# EAGLE design PiMometer (EAGLE 6.5.0)
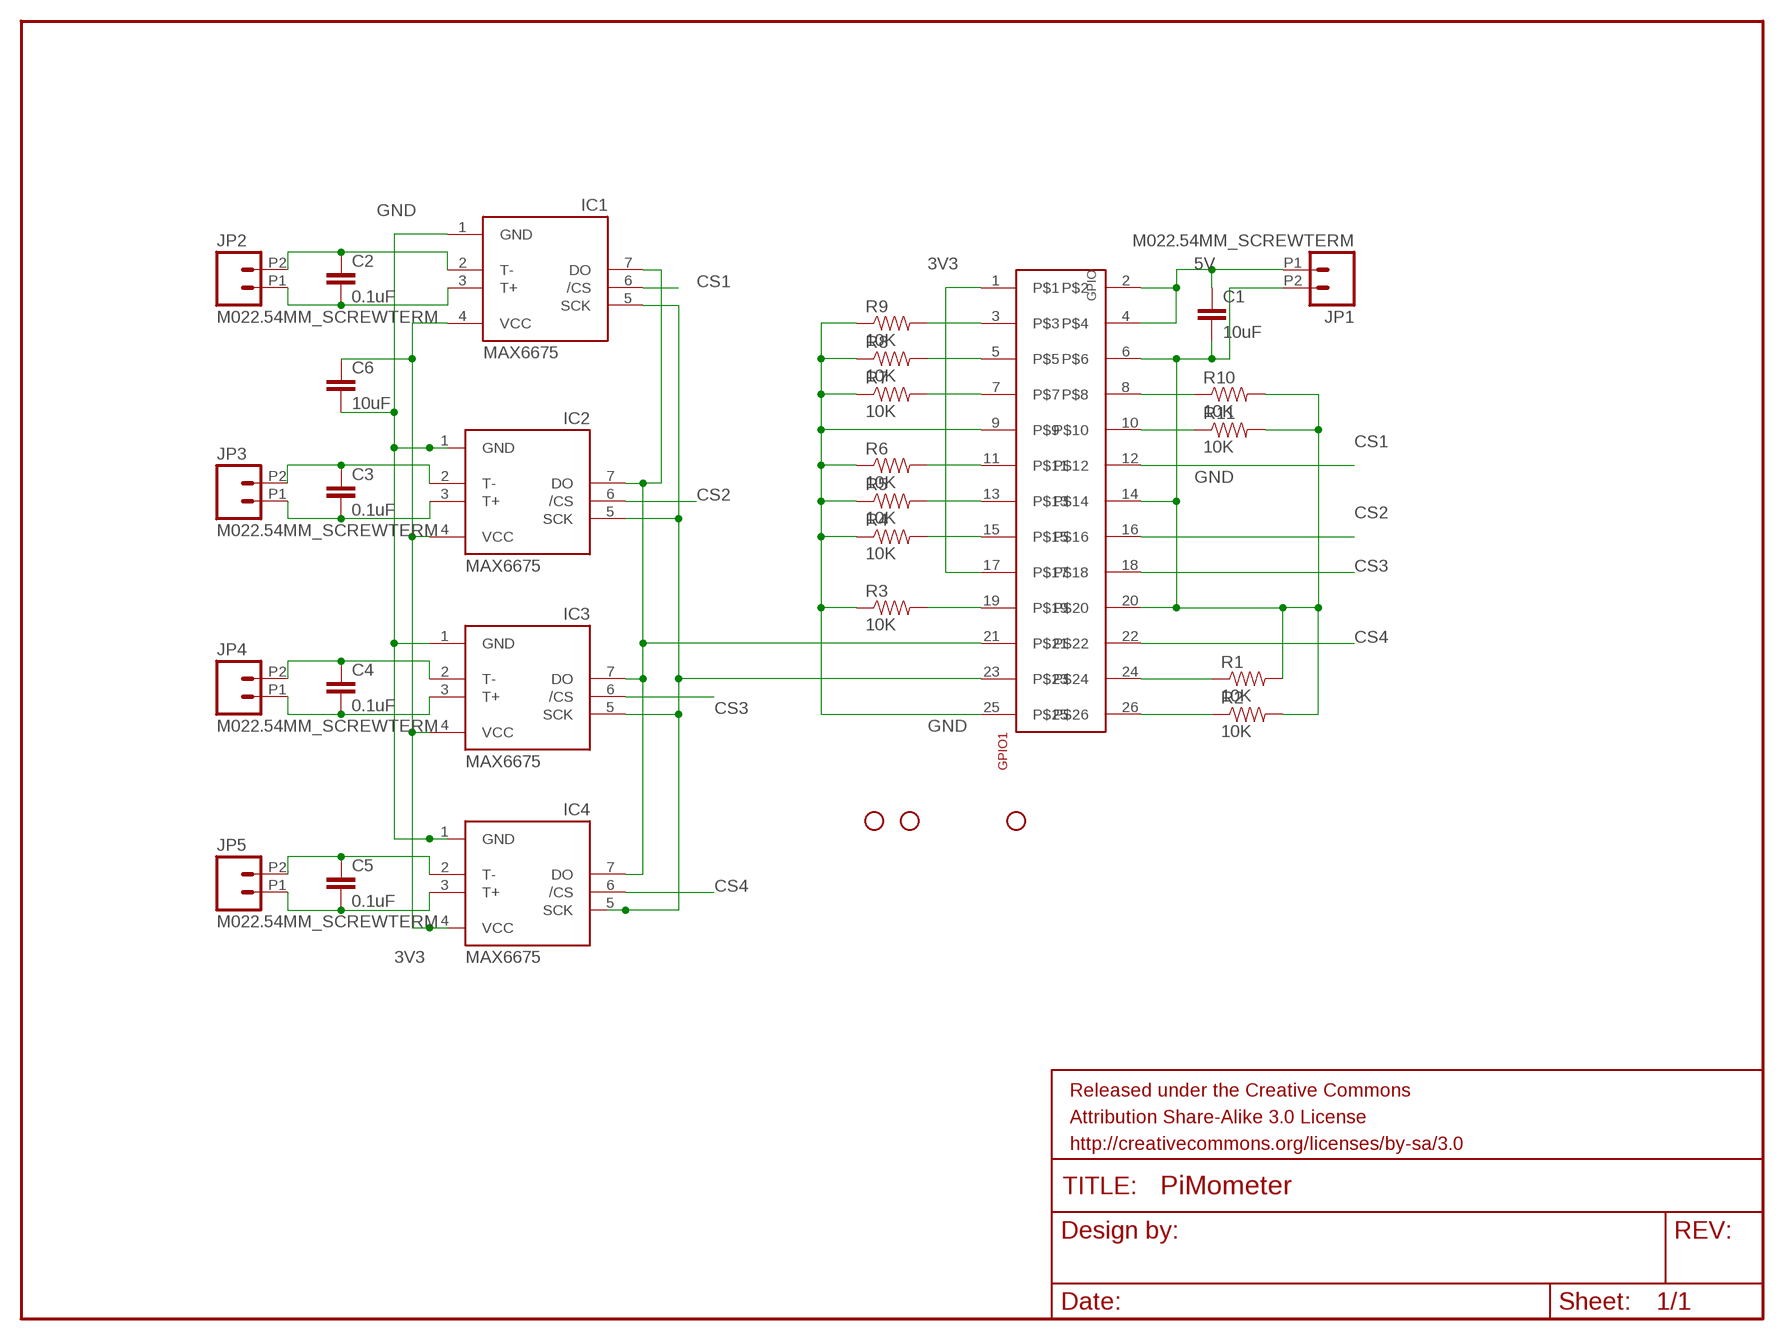
[diagram p0: schematic, sheet 1]

## Parts
C1  10uF  10UF50V20%(1210)  [1210]
C2  0.1uF  0.1UF-100V-10%(0603)  [0603-CAP]
C3  0.1uF  0.1UF-100V-10%(0603)  [0603-CAP]
C4  0.1uF  0.1UF-100V-10%(0603)  [0603-CAP]
C5  0.1uF  0.1UF-100V-10%(0603)  [0603-CAP]
C6  10uF  10UF50V20%(1210)  [1210]
FRAME1  FRAME-LETTER  [CREATIVE_COMMONS]
GPIO1  2X132X13  [2X13]
IC1  MAX6675  [SO08]
IC2  MAX6675  [SO08]
IC3  MAX6675  [SO08]
IC4  MAX6675  [SO08]
JP1  M022.54MM_SCREWTERM  [1X02_2.54_SCREWTERM]
JP2  M022.54MM_SCREWTERM  [1X02_2.54_SCREWTERM]
JP3  M022.54MM_SCREWTERM  [1X02_2.54_SCREWTERM]
JP4  M022.54MM_SCREWTERM  [1X02_2.54_SCREWTERM]
JP5  M022.54MM_SCREWTERM  [1X02_2.54_SCREWTERM]
R1  10K  10KOHM1/10W1%(0603)0603  [0603-RES]
R2  10K  10KOHM1/10W1%(0603)0603  [0603-RES]
R3  10K  10KOHM1/10W1%(0603)0603  [0603-RES]
R4  10K  10KOHM1/10W1%(0603)0603  [0603-RES]
R5  10K  10KOHM1/10W1%(0603)0603  [0603-RES]
R6  10K  10KOHM1/10W1%(0603)0603  [0603-RES]
R7  10K  10KOHM1/10W1%(0603)0603  [0603-RES]
R8  10K  10KOHM1/10W1%(0603)0603  [0603-RES]
R9  10K  10KOHM1/10W1%(0603)0603  [0603-RES]
R10  10K  10KOHM1/10W1%(0603)0603  [0603-RES]
R11  10K  10KOHM1/10W1%(0603)0603  [0603-RES]
STANDOFF1  STAND-OFF  [STAND-OFF]
STANDOFF2  STAND-OFF  [STAND-OFF]
STANDOFF4  STAND-OFF  [STAND-OFF]

## Nets
3V3: C6.1 GPIO1.1 GPIO1.17 IC1.4(VCC) IC2.4(VCC) IC3.4(VCC) IC4.4(VCC)
5V: C1.1 GPIO1.2 GPIO1.4 JP1.P1
CS1: GPIO1.12 IC1.6(/CS)
CS2: GPIO1.16 IC2.6(/CS)
CS3: GPIO1.18 IC3.6(/CS)
CS4: GPIO1.22 IC4.6(/CS)
GND: C1.2 C6.2 GPIO1.6 GPIO1.9 GPIO1.14 GPIO1.20 GPIO1.25 IC1.1(GND) IC2.1(GND) IC3.1(GND) IC4.1(GND) JP1.P2 R1.2 R2.2 R3.1 R4.1 R5.1 R6.1 R7.1 R8.1 R9.1 R10.2 R11.2
N$1: GPIO1.21 IC1.7(DO) IC2.7(DO) IC3.7(DO) IC4.7(DO)
N$2: GPIO1.23 IC1.5(SCK) IC2.5(SCK) IC3.5(SCK) IC4.5(SCK)
N$3: GPIO1.24 R1.1
N$5: GPIO1.26 R2.1
N$6: C2.1 IC1.2(T-) JP2.P2
N$7: C2.2 IC1.3(T+) JP2.P1
N$8: GPIO1.3 R9.2
N$9: GPIO1.5 R8.2
N$10: GPIO1.7 R7.2
N$11: GPIO1.11 R6.2
N$12: GPIO1.13 R5.2
N$13: GPIO1.15 R4.2
N$14: GPIO1.19 R3.2
N$15: GPIO1.8 R10.1
N$16: GPIO1.10 R11.1
N$18: C3.1 IC2.2(T-) JP3.P2
N$20: C3.2 IC2.3(T+) JP3.P1
N$22: C4.1 IC3.2(T-) JP4.P2
N$23: C4.2 IC3.3(T+) JP4.P1
N$24: C5.1 IC4.2(T-) JP5.P2
N$25: C5.2 IC4.3(T+) JP5.P1

## Library data of the parts
C1 C6 = SparkFun-Capacitors:10UF50V20%(1210): CAP-09824; PROD_ID: CAP-09824
C2-C5 = SparkFun-Capacitors:0.1UF-100V-10%(0603): CAP-08390; PROD_ID: CAP-08390
FRAME1 = SparkFun-Aesthetics:FRAME-LETTER: Schematic Frame Standard 8.5x11 US Letter frame
GPIO1 = rpi-header:2X13
IC1-IC4 = adafruit:MAX6675
JP1-JP5 = SparkFun-Connectors:M02: Standard 2-pin 0.1" header. Use with - straight break away headers ( PRT-00116) - right angle break away headers (PRT-00553) - swiss pins (PRT-00743) - machine pins (PRT-00117) - female headers (PRT-00115) Molex polarized connector foot print use with: PRT-08233 with associated crimp pins and housings. 2.54_SCREWTERM for use with PRT-10571. 3.5mm Screw Terminal footprints for PRT-08084 5mm Screw Terminal footprints for use with PRT-08433
R1-R11 = SparkFun-Resistors:10KOHM1/10W1%(0603): RES-00824; PROD_ID: RES-00824
STANDOFF1 STANDOFF2 STANDOFF4 = SparkFun-Electromechanical:STAND-OFF: #4 Stand Off This is the mechanical footprint for a #4 phillips button head screw. Use the keepout ring to avoid running the screw head into surrounding components. SKU : PRT-00447

## Board
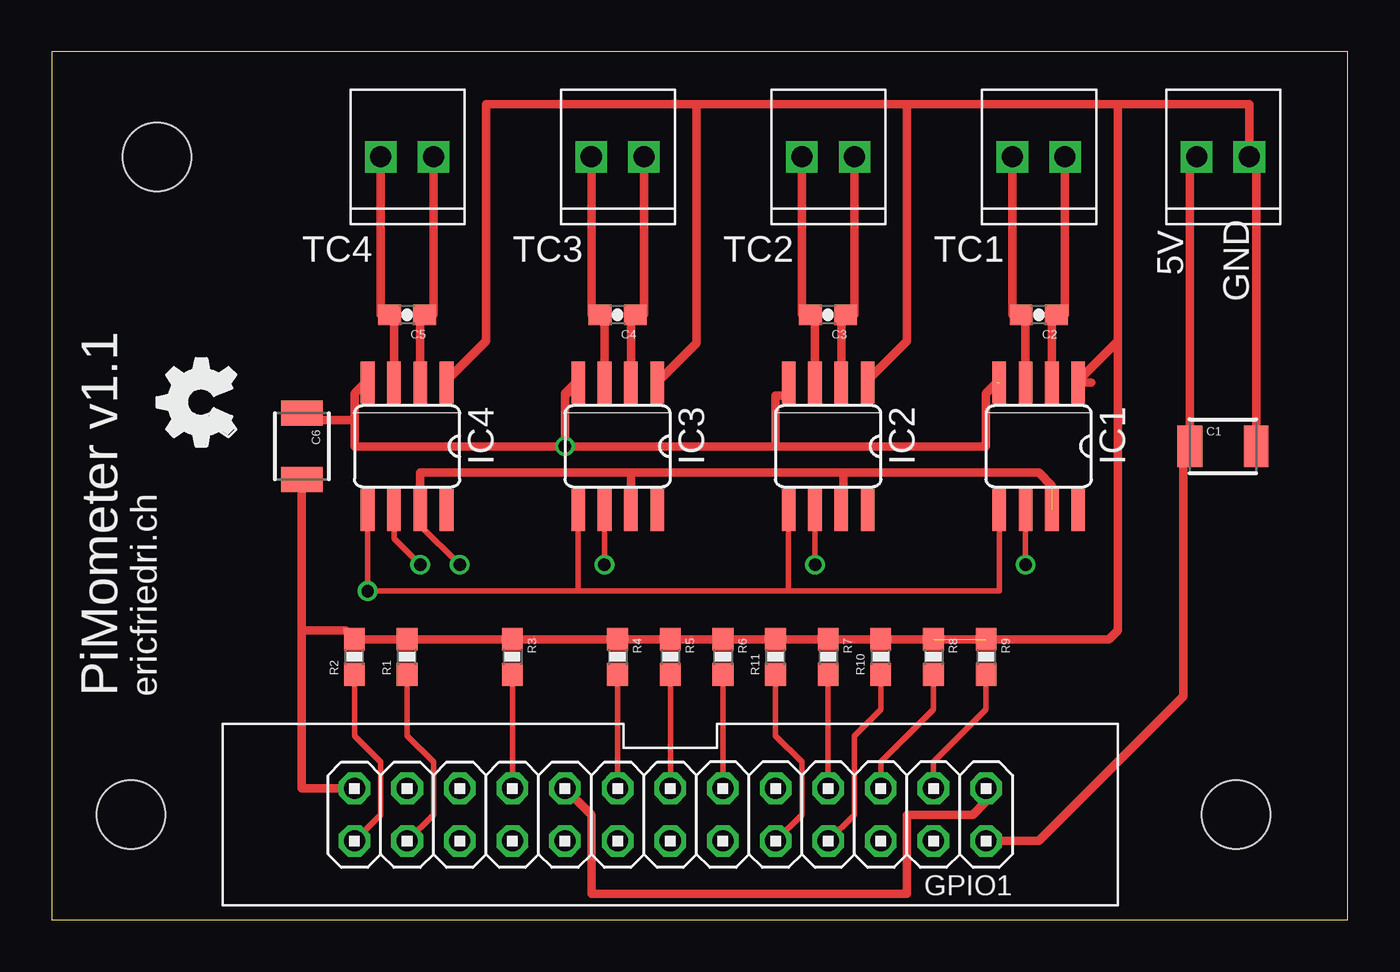
[diagram p1: board, top side]
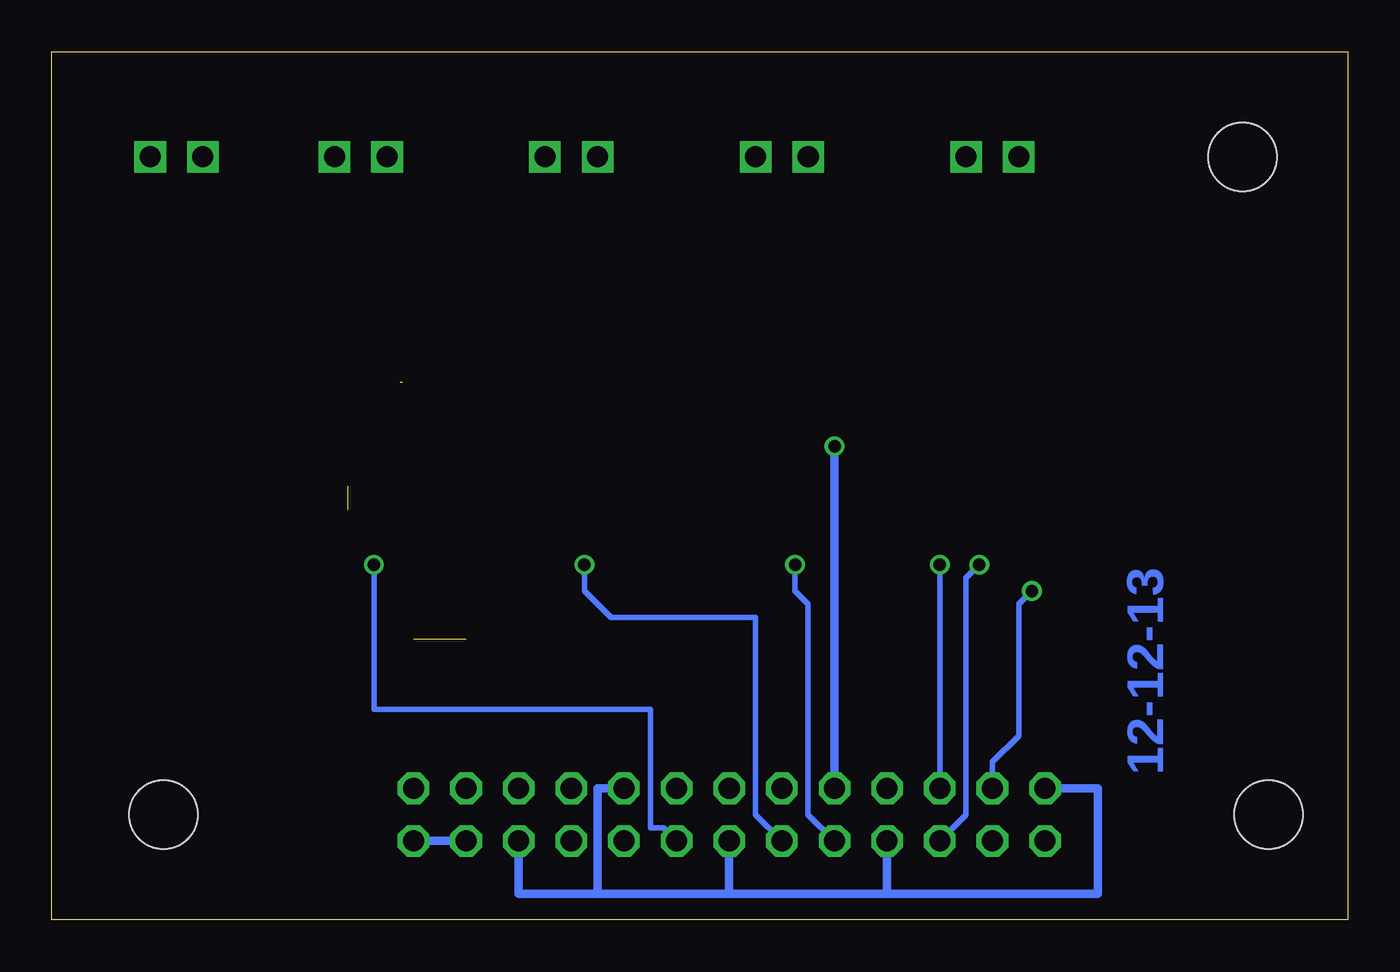
[diagram p2: board, bottom side, seen from below]

Size 62.53 x 41.9 mm. Coordinates in mm from the lower left corner, seen from the top.
Outline: 0,0 62.53,0 62.53,41.9 0,41.9 0,0
Copper layers (1*16): Top 0.0356mm / dielectric 1.5011mm / Bottom 0.0356mm
Design rules "LaenPCBOrder": minimum track width 6mil, minimum drill 13mil, track to track 6mil, track to pad 6mil, pad to pad 6mil, via to via 6mil, smd to smd 6mil, copper to edge 15mil, drill to drill 6mil, minimum pad ring 7mil, minimum via ring 7mil, stop-mask expansion 3mil, vias tented up to drill 0mil, thermal gap 10mil

### Footprints (pad centres in the part's own frame; a part is rotated, then mirrored left to right if it is on the bottom)
1210 = smd 1.2 x 2: 1 -1.6,0; 2 1.6,0
0603-CAP = smd 1.1 x 1: 1 -0.85,0; 2 0.85,0
2X13 = drill 1.016 octagon: 1 -15.24,-1.27; 2 -15.24,1.27; 3 -12.7,-1.27; 4 -12.7,1.27; 5 -10.16,-1.27; 6 -10.16,1.27; 7 -7.62,-1.27; 8 -7.62,1.27; 9 -5.08,-1.27; 10 -5.08,1.27; 11 -2.54,-1.27; 12 -2.54,1.27; 13 0,-1.27; 14 0,1.27; 15 2.54,-1.27; 16 2.54,1.27; 17 5.08,-1.27; 18 5.08,1.27; 19 7.62,-1.27; 20 7.62,1.27; 21 10.16,-1.27; 22 10.16,1.27; 23 12.7,-1.27; 24 12.7,1.27; 25 15.24,-1.27; 26 15.24,1.27
SO08 = smd 0.66 x 2.032: 1 -1.905,-3.073; 2 -0.635,-3.073; 3 0.635,-3.073; 4 1.905,-3.073; 5 1.905,3.073; 6 0.635,3.073; 7 -0.635,3.073; 8 -1.905,3.073
1X02_2.54_SCREWTERM = drill 1.016 square: P1 2.54,0; P2 0,0
0603-RES = smd 1.1 x 1: 1 -0.85,0; 2 0.85,0
STAND-OFF = hole 3.302: 0,0

### Placement (x,y rotation side)
C1  56.52,22.86 0 top
C2  47.62,29.21 180 top
C3  37.47,29.21 180 top
C4  27.3,29.21 180 top
C5  17.14,29.21 180 top
C6  12.06,22.86 270 top
FRAME1  20.95,-31.11 0 top  (outside the outline)
GPIO1  29.84,5.08 180 top
IC1  47.62,22.86 180 top
IC2  37.47,22.86 180 top
IC3  27.3,22.86 180 top
IC4  17.14,22.86 180 top
JP1  57.78,36.83 180 top
JP2  48.9,36.83 180 top
JP3  38.73,36.83 180 top
JP4  28.57,36.83 180 top
JP5  18.41,36.83 180 top
R1  17.14,12.7 90 top
R2  14.61,12.7 90 top
R3  22.23,12.7 270 top
R4  27.3,12.7 270 top
R5  29.84,12.7 270 top
R6  32.38,12.7 270 top
R7  37.47,12.7 270 top
R8  42.55,12.7 270 top
R9  45.09,12.7 270 top
R10  40.01,12.7 90 top
R11  34.92,12.7 90 top
STANDOFF1  5.08,36.83 0 top
STANDOFF2  57.15,5.08 0 top
STANDOFF4  3.81,5.08 0 top
U$1  [OSHW_FILLX150_NOTEXT]  8.89,22.86 90 top

### Tracks (layer width: path | path; a pad name or v marks a point on that pad's centre or on a via)
3V3  (via drill 0.6)  (1 unrouted)
  Top 0.406: 45.62,25.93 45.09,25.4 45.09,22.86 34.92,22.86 | 34.92,22.86 34.92,25.3 35.56,25.3 IC2.4 | IC4.4 15.14,25.93 14.61,25.4 14.61,24.13 | 24.77,25.3 IC3.4 25.3,25.93 24.77,25.4 24.77,25.3 | v24.77,22.86 34.92,22.86 | 14.61,24.13 14.61,22.86 v24.77,22.86 | 14.61,24.13 12.39,24.13 C6.1 | GPIO1.1 45.09,5.71 44.45,5.08 41.27,5.08 41.27,1.27 26.04,1.27 26.04,5.08 GPIO1.17 | 24.77,25.3 v24.77,22.86
  Bottom 0.406: v24.77,22.86 GPIO1.17
5V
  Top 0.406: JP1.P1 54.91,36.83 C1.1 54.61,22.55 54.61,10.79 47.62,3.81 GPIO1.2
  Bottom 0.406: GPIO1.4 GPIO1.2
CS1  (via drill 0.6)
  Top 0.254: IC1.6 v46.99,17.14
  Bottom 0.254: v46.99,17.14 46.99,10.16 33.66,10.16 33.66,4.45 33.02,4.45 GPIO1.12
CS2  (via drill 0.6)
  Top 0.254: IC2.6 v36.83,17.14
  Bottom 0.254: v36.83,17.14 36.83,15.88 35.56,14.61 28.57,14.61 28.57,5.08 GPIO1.16
CS3  (via drill 0.6)
  Top 0.254: IC3.6 v26.67,17.14
  Bottom 0.254: v26.67,17.14 26.67,15.88 26.04,15.24 26.04,5.08 GPIO1.18
CS4  (via drill 0.6)
  Top 0.254: IC4.6 16.51,18.41 v17.78,17.14
  Bottom 0.254: v17.78,17.14 18.41,16.51 18.41,5.08 GPIO1.22
GND  (1 unrouted)
  Top 0.406: 50.16,25.93 IC1.1 49.53,26.04 51.44,27.94 | 31.11,39.37 20.95,39.37 20.95,27.94 19.05,26.04 IC4.1 | 31.11,39.37 31.11,27.84 IC3.1 | IC2.1 39.37,26.04 41.27,27.94 41.27,39.37 | 41.27,39.37 31.11,39.37 | 51.44,39.37 41.27,39.37 | R10.2 R11.2 R6.1 R5.1 R4.1 R3.1 R1.2 R2.2 14.19,13.97 12.06,13.97 | R10.2 R8.1 51.02,13.55 51.44,13.97 51.44,27.94 | R10.2 R7.1 | 51.44,39.37 57.78,39.37 JP1.P2 58.12,36.5 C1.2 | GPIO1.25 12.06,6.35 12.06,13.97 | 51.44,27.94 51.44,39.37 | C6.2 12.06,13.97
  Bottom 0.406: 22.23,1.27 12.06,1.27 12.06,6.35 GPIO1.25 | 22.23,1.27 29.84,1.27 | 29.84,1.27 36.2,1.27 | 36.2,1.27 40.01,1.27 GPIO1.6 | GPIO1.14 29.84,1.27 | GPIO1.20 22.23,1.27 | GPIO1.9 36.2,6.35 36.2,1.27
N$1  (via drill 0.6)  (1 unrouted)
  Top 0.254: IC4.7 17.78,19.05 v19.68,17.14
  Top 0.406: 48.26,20.95 47.62,21.59 38.1,21.59 | IC2.7 38.2,19.79 38.2,21.49 38.1,21.59 | 38.1,21.59 27.94,21.59 | 27.94,21.59 17.78,21.59 IC4.7 | IC3.7 27.94,21.59
  Bottom 0.254: v19.68,17.14 GPIO1.21
N$2  (via drill 0.6)
  Top 0.254: IC4.5 v15.24,15.88 25.4,15.88 | 25.4,15.88 35.56,15.88 | 35.56,15.88 IC2.5 | IC3.5 25.4,15.88 | IC1.5 45.72,15.88 35.56,15.88
  Bottom 0.254: v15.24,15.88 15.88,15.24 15.88,8.89 17.14,7.62 GPIO1.23
N$3
  Top 0.254: GPIO1.24 18.41,5.08 18.41,7.62 17.14,8.89 R1.1
N$5
  Top 0.254: GPIO1.26 15.88,5.08 15.88,7.62 14.61,8.89 R2.1
N$6
  Top 0.406: JP2.P2 48.9,29.21 C2.1 48.26,29.21 IC1.2
N$7
  Top 0.406: JP2.P1 46.35,29.21 C2.2 46.99,29.21 IC1.3
N$8
  Top 0.254: GPIO1.3 42.55,7.62 45.09,10.16 R9.2
N$9
  Top 0.254: GPIO1.5 40.01,7.62 42.55,10.16 R8.2
N$10
  Top 0.254: GPIO1.7 R7.2
N$11
  Top 0.254: R6.2 GPIO1.11
N$12
  Top 0.254: GPIO1.13 R5.2
N$13
  Top 0.254: R4.2 GPIO1.15
N$14
  Top 0.254: GPIO1.19 R3.2
N$15
  Top 0.254: GPIO1.8 38.73,5.08 38.73,8.89 40.01,10.16 R10.1
N$16
  Top 0.254: R11.1 34.92,8.89 36.2,7.62 36.2,5.08 GPIO1.10
N$18
  Top 0.406: JP3.P2 38.73,29.21 C3.1 38.1,29.21 IC2.2
N$20
  Top 0.406: JP3.P1 36.2,29.21 C3.2 36.83,29.21 IC2.3
N$22
  Top 0.406: JP4.P2 28.57,29.21 C4.1 27.94,29.21 IC3.2
N$23
  Top 0.406: JP4.P1 26.04,29.21 C4.2 26.67,29.21 IC3.3
N$24
  Top 0.406: JP5.P2 18.41,29.21 C5.1 17.78,29.21 IC4.2
N$25
  Top 0.406: JP5.P1 15.88,29.21 C5.2 16.51,29.21 IC4.3

### Text on the board
Bottom: 12-12-13
tNames: TC4 | TC3 | TC2 | TC1 | 5V | GND | PiMometer v1.1 | ericfriedri.ch